# EAGLE design Tyre temperature sensor PCB (EAGLE 9.4.0)
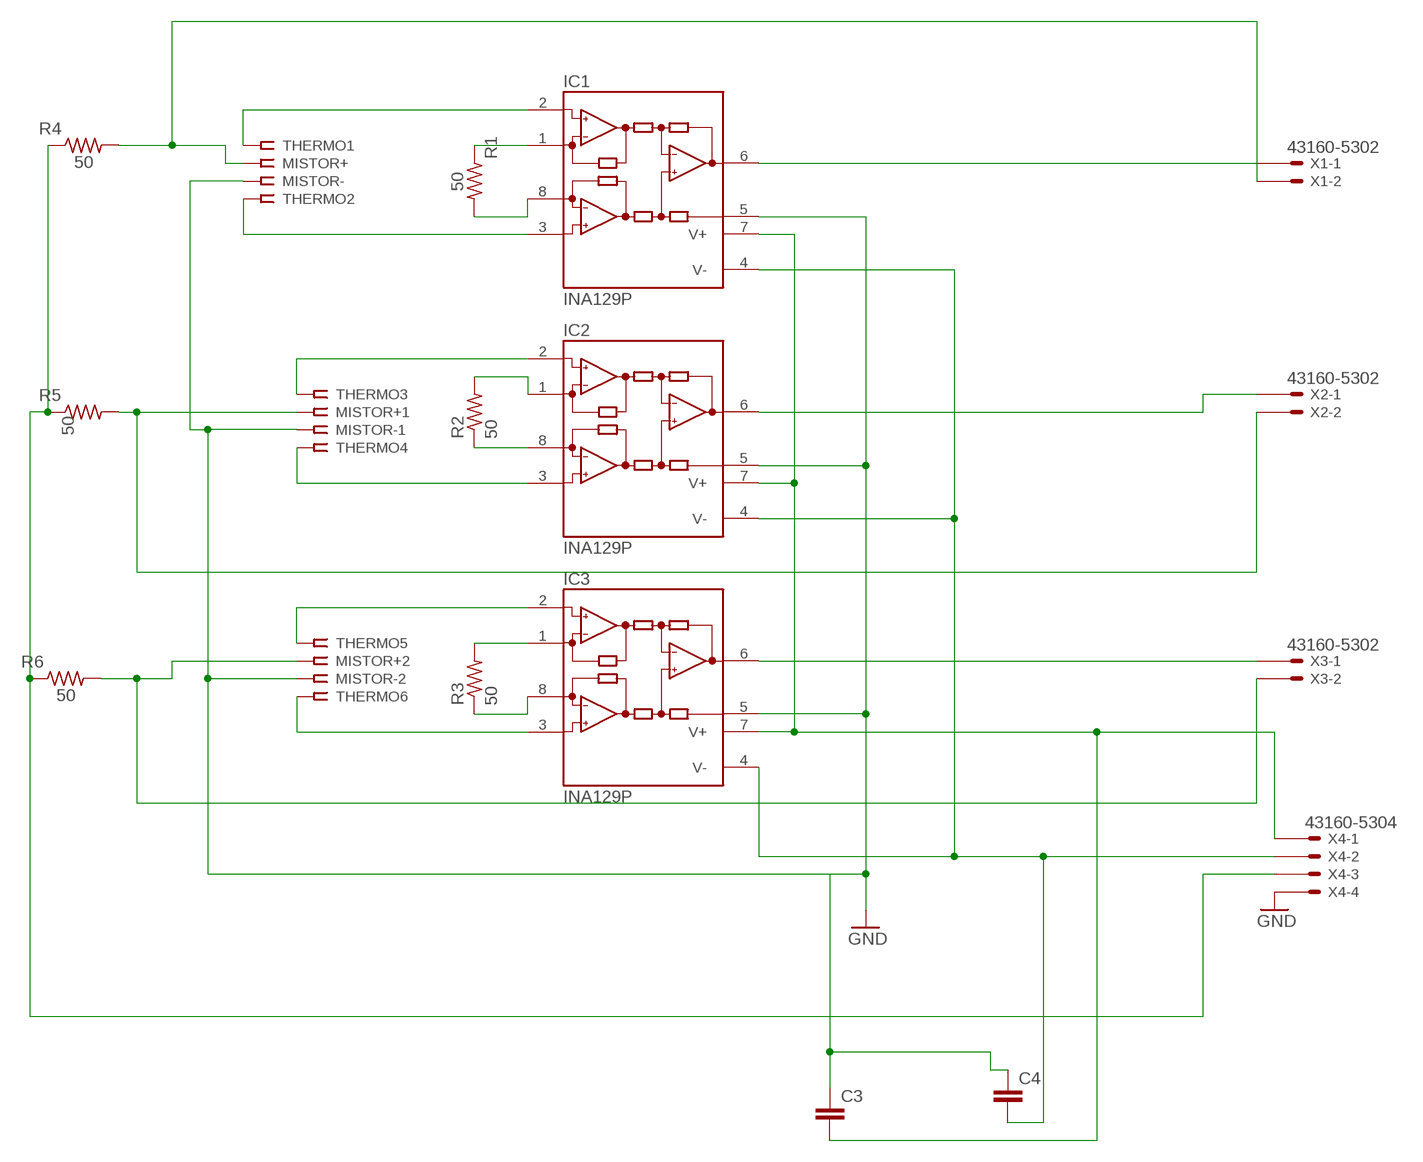
[diagram p0: schematic, sheet 1]

## Parts
C3  C5/2.5  [C5B2.5]
C4  C5/2.5  [C5B2.5]
IC1  INA129P  [DIL08]
IC2  INA129P  [DIL08]
IC3  INA129P  [DIL08]
MISTOR+  SSW-101-02-G-S  [SSW-101-02-G-S]
MISTOR+1  SSW-101-02-G-S  [SSW-101-02-G-S]
MISTOR+2  SSW-101-02-G-S  [SSW-101-02-G-S]
MISTOR-  SSW-101-02-G-S  [SSW-101-02-G-S]
MISTOR-1  SSW-101-02-G-S  [SSW-101-02-G-S]
MISTOR-2  SSW-101-02-G-S  [SSW-101-02-G-S]
R1  50  R-US_0204/5  [0204/5]
R2  50  R-US_0204/5  [0204/5]
R3  50  R-US_0204/5  [0204/5]
R4  50  R-US_0204/5  [0204/5]
R5  50  R-US_0204/5  [0204/5]
R6  50  R-US_0204/5  [0204/5]
THERMO1  SSW-101-02-G-S  [SSW-101-02-G-S]
THERMO2  SSW-101-02-G-S  [SSW-101-02-G-S]
THERMO3  SSW-101-02-G-S  [SSW-101-02-G-S]
THERMO4  SSW-101-02-G-S  [SSW-101-02-G-S]
THERMO5  SSW-101-02-G-S  [SSW-101-02-G-S]
THERMO6  SSW-101-02-G-S  [SSW-101-02-G-S]
X1  43160-5302  [43160-XX02]
X2  43160-5302  [43160-XX02]
X3  43160-5302  [43160-XX02]
X4  43160-5304  [43160-XX04]

## Nets
GND: C3.1 C4.1 IC1.5(REF) IC2.5(REF) IC3.5(REF) MISTOR-1.1 MISTOR-2.1 MISTOR-.1 X4.4@1(-4:S)
N$1: IC1.1(RG) R1.1
N$2: IC1.8(RG) R1.2
N$3: IC2.1(RG) R2.2
N$4: IC2.8(RG) R2.1
N$5: IC3.1(RG) R3.2
N$6: IC3.8(RG) R3.1
N$7: IC1.3(+IN) THERMO2.1
N$8: IC1.2(-IN) THERMO1.1
N$9: IC2.3(+IN) THERMO4.1
N$10: IC2.2(-IN) THERMO3.1
N$11: IC3.3(+IN) THERMO6.1
N$12: IC3.2(-IN) THERMO5.1
N$13: MISTOR+.1 R4.2 X1.2@1(-2:S)
N$14: IC1.6(OUT) X1.1@1(-1:S)
N$15: IC2.6(OUT) X2.1@1(-1:S)
N$16: IC3.6(OUT) X3.1@1(-1:S)
N$17: C3.2 IC1.7(V+) IC2.7(V+) IC3.7(V+) X4.1@1(-1:S)
N$18: C4.2 IC1.4(V-) IC2.4(V-) IC3.4(V-) X4.2@1(-2:S)
N$19: MISTOR+1.1 R5.2 X2.2@1(-2:S)
N$20: MISTOR+2.1 R6.2 X3.2@1(-2:S)
N$21: R4.1 R5.1 R6.1 X4.3@1(-3:S)
Unconnected: X1.1@2(-1:S) X1.2@2(-2:S) X2.1@2(-1:S) X2.2@2(-2:S) X3.1@2(-1:S) X3.2@2(-2:S) X4.1@2(-1:S) X4.2@2(-2:S) X4.3@2(-3:S) X4.4@2(-4:S)

## Library data of the parts
C3 C4 = capacitor-wima:C: CAPACITOR naming: grid - package width
IC1-IC3 = burr-brown:INA129: Instrumentation Amplifiers Precision, Low Power; MF: TEXAS INSTRUMENTS; MPN: INA129P; OC_FARNELL: 1212414; OC_NEWARK: 74C9786
MISTOR+ MISTOR+1 MISTOR+2 MISTOR- MISTOR-1 MISTOR-2 THERMO1-THERMO6 = con-samtec:SSW-101-02-G-S: THROUGH-HOLE .025" SQ POST SOCKET Source: Samtec SSW.pdf; MF: Samtec Inc.; MPN: SSW-101-02-G-S; OC_FARNELL: unknown; OC_NEWARK: 11P9336
R1-R6 = rcl:R-US_: RESISTOR, American symbol; SPICEPREFIX: R
X1-X3 = con-molex:43160-*02: SDA-43160 Connector Source: http://www.molex.com/pdm_docs/sd/431601306_sd.pdf; MF: MOLEX; MPN: 43160-5302; OC_FARNELL: unknown; OC_NEWARK: 92M1498
X4 = con-molex:43160-*04: SDA-43160 Connector Source: http://www.molex.com/pdm_docs/sd/431601306_sd.pdf; MF: MOLEX; MPN: 43160-5304; OC_FARNELL: unknown; OC_NEWARK: 92M1500

## Board
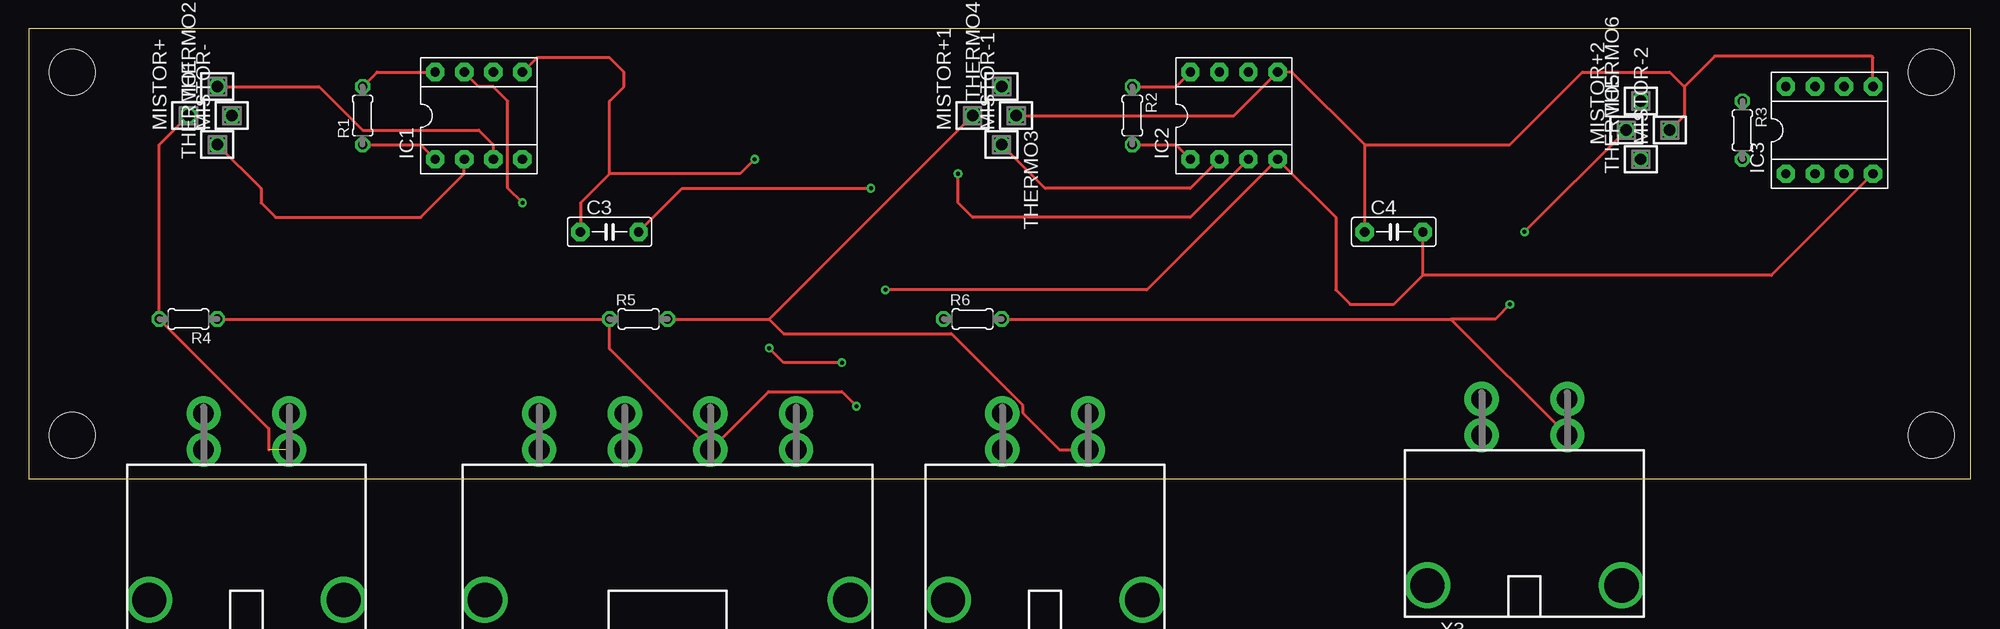
[diagram p1: board, top side]
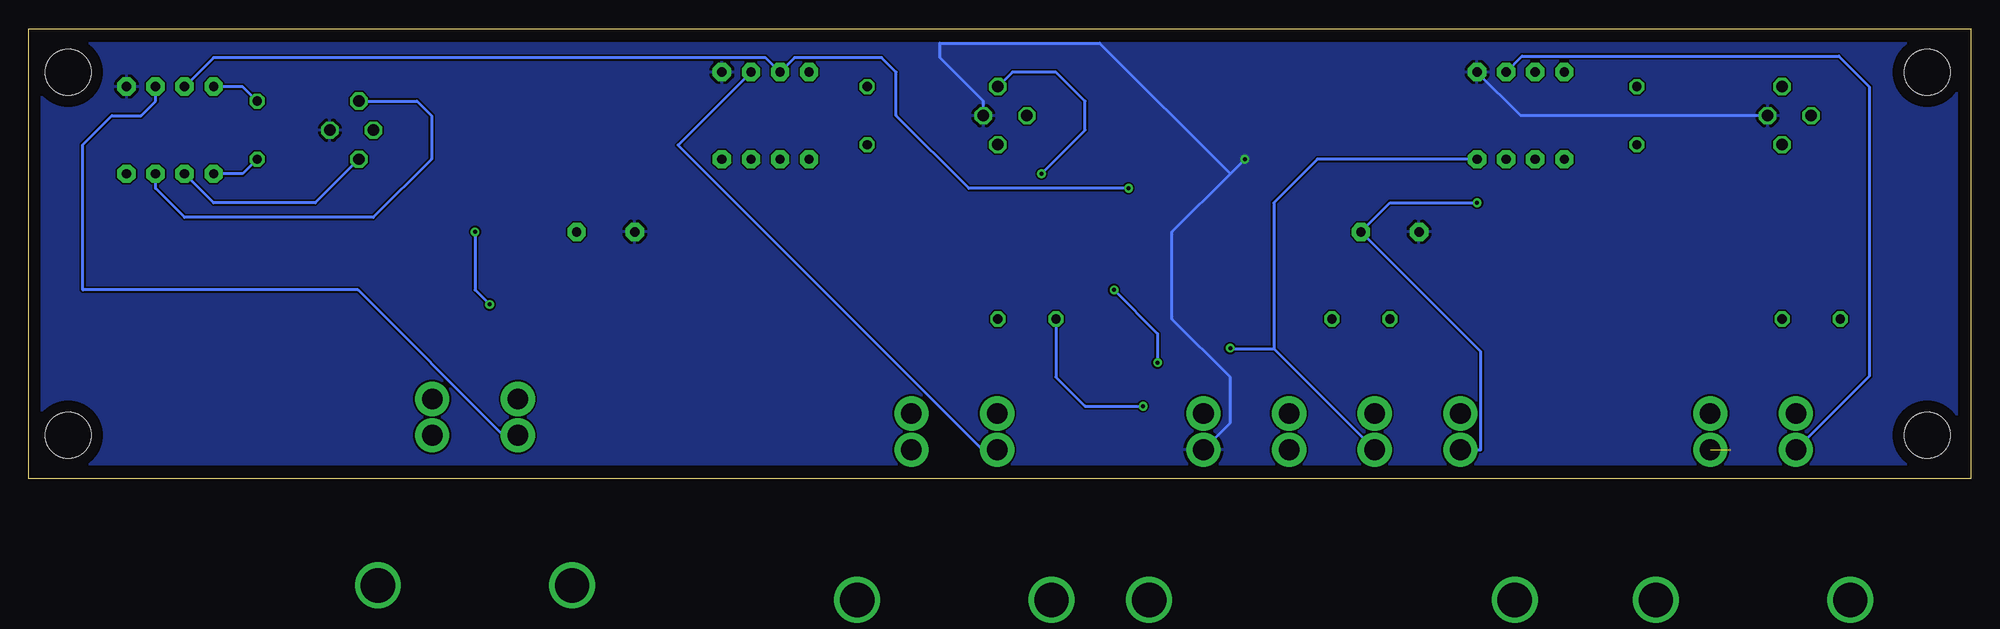
[diagram p2: board, bottom side, seen from below]

Size 169.85 x 39.36 mm. Coordinates in mm from the lower left corner, seen from the top.
Outline: 0,0 169.85,0 169.85,39.36 0,39.36 0,0
Copper layers (1*16): Top 0.035mm / dielectric 1.5mm / Bottom 0.035mm
Design rules "default": minimum track width 6mil, minimum drill 0.35mm, track to track 6mil, track to pad 6mil, pad to pad 6mil, via to via 6mil, smd to smd 6mil, copper to edge 40mil, drill to drill 6mil, minimum pad ring 10mil, minimum via ring 8mil, stop-mask expansion 4mil, vias tented up to drill 0mil, thermal gap 10mil
Holes 4 mm at 3.81,3.81 3.81,35.56 166.37,35.56 166.37,3.81

### Footprints (pad centres in the part's own frame; a part is rotated, then mirrored left to right if it is on the bottom)
C5B2.5 = drill 0.813 pad 1.6 octagon: 1 -2.54,0; 2 2.54,0
DIL08 = drill 0.813 pad 1.6 octagon: 1 -3.81,-3.81; 2 -1.27,-3.81; 3 1.27,-3.81; 4 3.81,-3.81; 5 3.81,3.81; 6 1.27,3.81; 7 -1.27,3.81; 8 -3.81,3.81
SSW-101-02-G-S = drill 1 pad 1.5 octagon: 1 0,0
0204/5 = drill 0.813 octagon: 1 -2.54,0; 2 2.54,0
43160-XX02 = drill 1.8 pad 3: 1@1 -3.745,0; 1@2 -3.745,3.18; 2@1 3.745,0; 2@2 3.745,3.18 | drill 3 pad 3.4: M1 -8.495,-13.13; M2 8.495,-13.13
43160-XX04 = drill 1.8 pad 3: 1@1 -11.235,0; 1@2 -11.235,3.18; 2@1 -3.745,0; 2@2 -3.745,3.18; 3@1 3.745,0; 3@2 3.745,3.18; 4@1 11.235,0; 4@2 11.235,3.18 | drill 3 pad 3.4: M1 -15.985,-13.13; M2 15.985,-13.13

### Placement (x,y rotation side)
C3  50.8,21.59 0 top
C4  119.38,21.59 0 top
IC1  39.37,31.75 0 top
IC2  105.41,31.75 0 top
IC3  157.48,30.48 0 top
MISTOR+  13.97,31.75 0 top
MISTOR+1  82.55,31.75 0 top
MISTOR+2  139.7,30.48 0 top
MISTOR-  17.78,31.75 0 top
MISTOR-1  86.36,31.75 0 top
MISTOR-2  143.51,30.48 0 top
R1  29.21,31.75 90 top
R2  96.52,31.75 270 top
R3  149.86,30.48 270 top
R4  13.97,13.97 180 top
R5  53.34,13.97 0 top
R6  82.55,13.97 0 top
THERMO1  16.51,29.21 0 top
THERMO2  16.51,34.29 0 top
THERMO3  85.09,29.21 180 top
THERMO4  85.09,34.29 0 top
THERMO5  140.97,27.94 0 top
THERMO6  140.97,33.02 0 top
X1  19.05,2.54 0 top
X2  88.9,2.54 0 top
X3  130.81,3.81 0 top
X4  55.88,2.54 0 top

### Tracks (layer width: path | path; a pad name or v marks a point on that pad's centre or on a via)
GND  (via drill 0.35)
  Top 0.254: v63.5,27.94 62.23,26.67 50.8,26.67 | 50.8,26.67 48.26,24.13 C3.1 | 50.8,26.67 50.8,33.02 52.07,34.29 52.07,35.56 50.8,36.83 44.45,36.83 IC1.5 | MISTOR-1.1 105.41,31.75 IC2.5 110.49,35.56 116.84,29.21 | C4.1 116.84,29.21 | 116.84,29.21 129.54,29.21 135.89,35.56 143.51,35.56 144.78,34.29 | 144.78,34.29 144.78,31.75 MISTOR-2.1 | IC3.5 161.29,36.83 161.17,36.95 147.44,36.95 144.78,34.29
  Bottom 0.254: MISTOR-.1 39.37,31.75 IC1.5 | 64.77,26.67 v63.5,27.94 | MISTOR-1.1 86.36,33.02 90.17,36.83 90.17,38.1 76.2,38.1 64.77,26.67 | X4.4@1 64.77,4.88 64.77,8.89 69.85,13.97 69.85,21.59 64.77,26.67
  pour Bottom: 1.27,38.1 1.27,1.27 167.64,1.27 168.91,2.54 168.91,36.83 167.64,38.1
N$1
  Top 0.254: R1.1 34.29,29.21 IC1.1
N$2
  Top 0.254: R1.2 30.48,35.56 IC1.8
N$3
  Top 0.254: R2.2 100.33,29.21 IC2.1
N$4
  Top 0.254: R2.1 100.33,34.29 IC2.8
N$5
  Bottom 0.254: R3.2 151.13,26.67 IC3.1
N$6
  Bottom 0.254: R3.1 151.13,34.29 IC3.8
N$7
  Top 0.254: THERMO2.1 25.4,34.29 29.21,30.48 39.37,30.48 40.64,29.21 IC1.3
N$8
  Top 0.254: THERMO1.1 20.32,25.4 20.32,24.13 21.59,22.86 34.29,22.86 38.1,26.67 IC1.2
N$9  (via drill 0.35)
  Top 0.254: IC2.3 101.6,22.86 82.55,22.86 81.28,24.13 v81.28,26.67
  Bottom 0.254: v81.28,26.67 77.47,30.48 77.47,33.02 80.01,35.56 83.82,35.56 THERMO4.1
N$10
  Top 0.254: IC2.2 101.6,25.4 88.9,25.4 THERMO3.1
N$11
  Bottom 0.254: THERMO6.1 135.89,33.02 134.62,31.75 134.62,27.94 139.7,22.86 156.21,22.86 158.75,25.4 IC3.3
N$12
  Bottom 0.254: THERMO5.1 144.78,24.13 153.67,24.13 IC3.2
N$13  (1 unrouted)
  Top 0.254: MISTOR+.1 11.43,29.21 R4.2 21.02,4.38 21.02,2.54
N$14
  Bottom 0.254: IC1.6 39.25,36.95 11.55,36.95 8.89,34.29 8.89,8.96 X1.1@1
N$15
  Bottom 0.254: X2.1@1 86.42,2.54 113.06,29.18 IC2.6
N$16
  Bottom 0.254: X3.1@1 128.34,3.81 141.03,16.51 165.1,16.51 165.1,29.21 162.56,31.75 160.02,31.75 158.75,33.02 IC3.6
N$17  (via drill 0.35)
  Top 0.254: C3.2 57.15,25.4 v73.66,25.4 | v43.18,24.13 41.91,25.4 41.91,33.02 40.64,34.29 39.37,34.29 IC1.7
  Bottom 0.254: v73.66,25.4 87.63,25.4 93.98,31.75 93.98,35.56 95.25,36.83 102.87,36.83 IC2.7 105.41,36.83 153.67,36.83 IC3.7 | X4.1@1 42.87,2.54 42.87,11.12 C3.2 50.8,24.13 v43.18,24.13
N$18  (via drill 0.35)
  Top 0.254: 121.92,17.78 119.38,15.24 115.57,15.24 114.3,16.51 114.3,22.86 IC2.4 97.79,16.51 v74.93,16.51 | 121.92,17.78 C4.2 | v71.12,10.16 66.04,10.16 v64.77,11.43 | IC3.4 152.4,17.78 121.92,17.78
  Bottom 0.254: IC1.4 57.15,27.94 60.96,24.13 60.96,11.37 | 60.96,11.37 X4.2@1 | v74.93,16.51 71.12,12.7 v71.12,10.16 | v64.77,11.43 64.7,11.37 60.96,11.37
N$19
  Top 0.254: R5.2 64.77,13.97 | MISTOR+1.1 64.77,13.97 | 64.77,13.97 66.04,12.7 80.69,12.7 86.93,6.46 86.93,5.78 90.17,2.54 X2.2@1
N$20  (via drill 0.35)
  Top 0.254: R6.2 124.39,13.97 | X3.2@1 124.39,13.97 | MISTOR+2.1 v130.81,21.59 | v129.54,15.24 128.27,13.97 124.39,13.97
  Bottom 0.254: v130.81,21.59 130.81,16.51 v129.54,15.24
N$21  (via drill 0.35)
  Top 0.254: R4.1 R5.1 50.8,11.37 X4.3@1 64.7,7.62 71.12,7.62 v72.39,6.35
  Bottom 0.254: R6.1 80.01,8.89 77.47,6.35 v72.39,6.35